# EAGLE design TriFet (EAGLE 6.2)
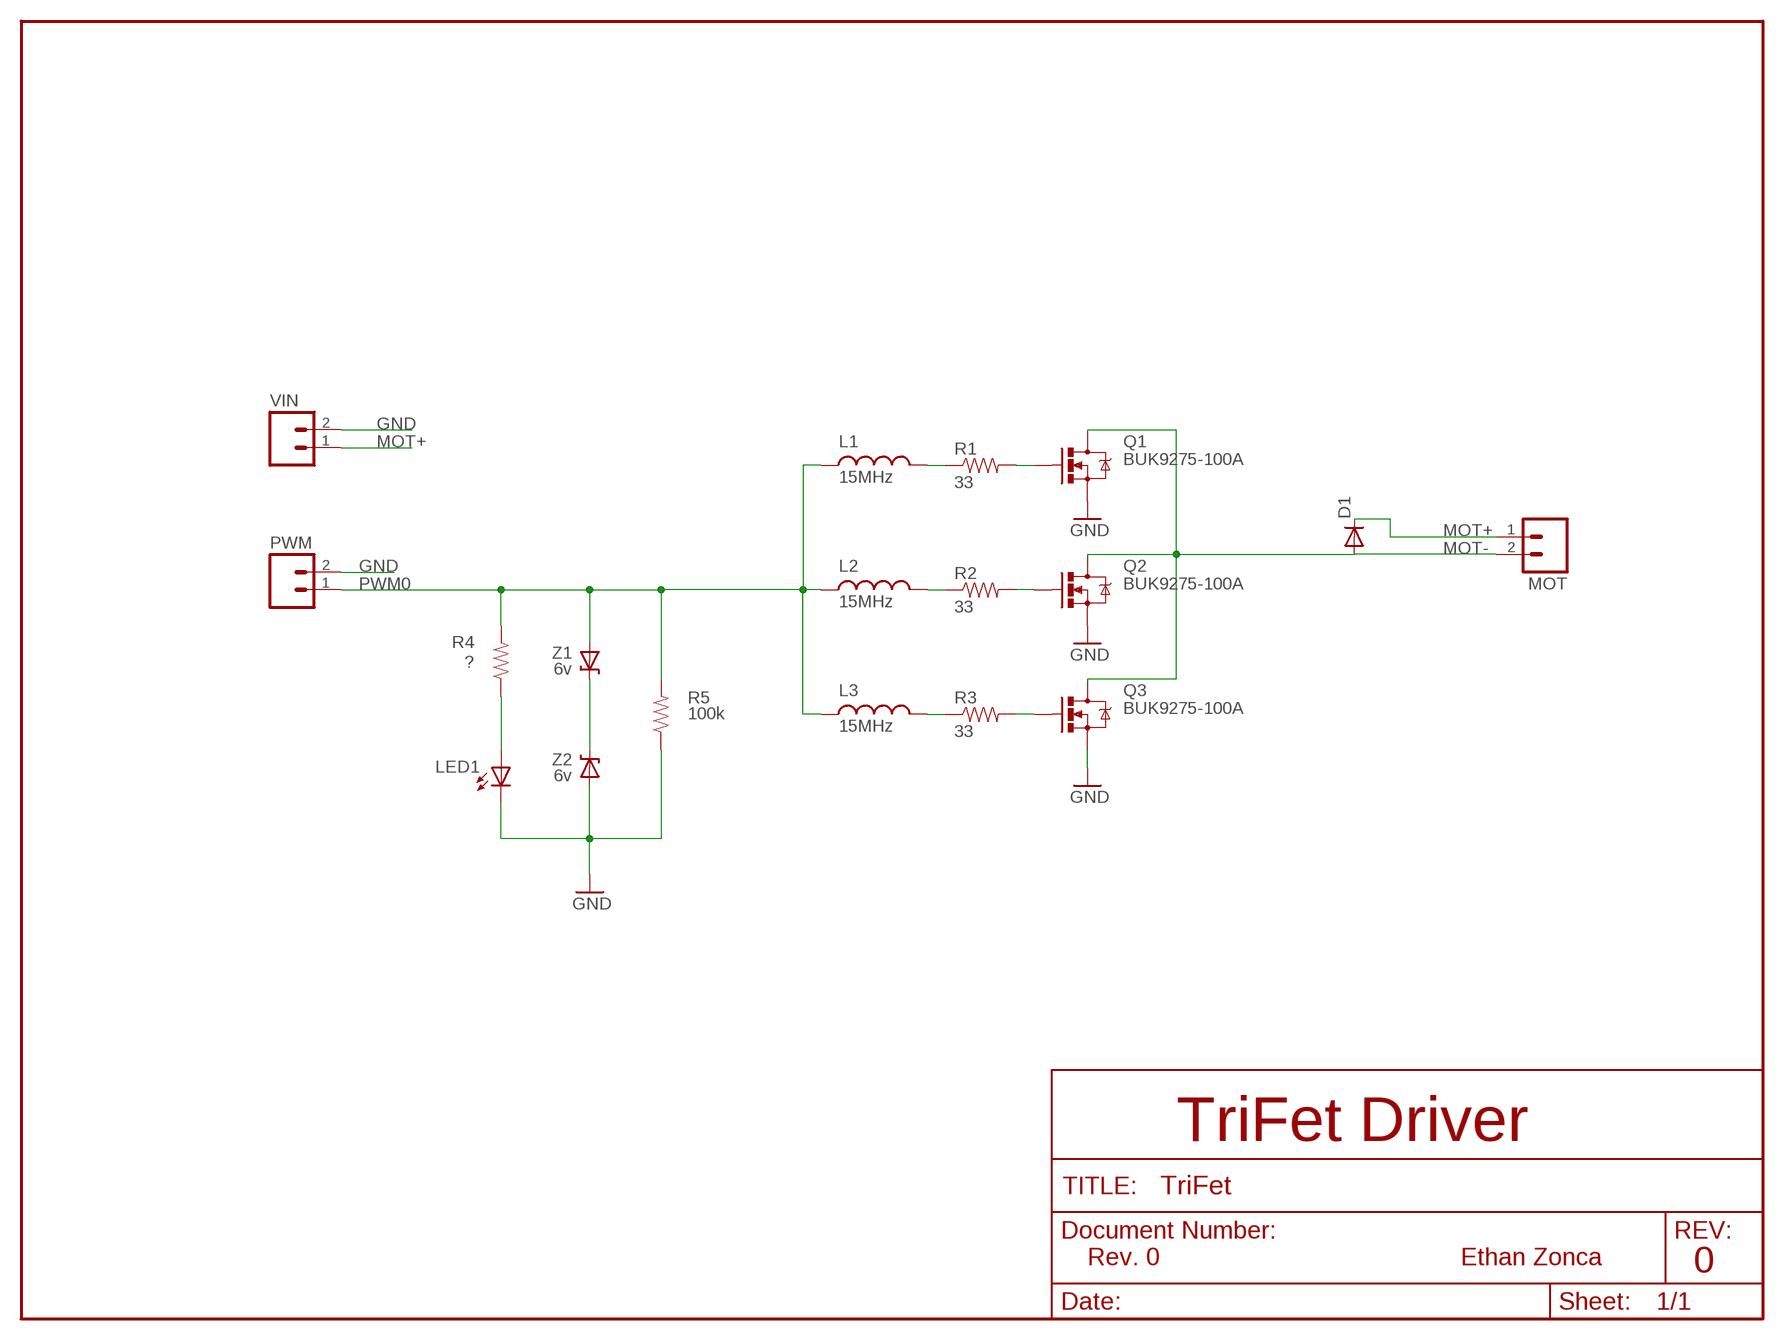
[diagram p0: schematic, sheet 1]

## Parts
D1  DIODESMB  [SMB-DIODE]
L1  15MHz  INDUCTOR0603  [0603]
L2  15MHz  INDUCTOR0603  [0603]
L3  15MHz  INDUCTOR0603  [0603]
LED1  LEDCHIP-LED0603  [CHIP-LED0603]
MOT  M023.5MM  [SCREWTERMINAL-3.5MM-2]
PWM  M023.5MM-NO_SILK  [SCREWTERMINAL-3.5MM-2-NS]
Q1  BUK9275-100A  MOSFET-NCHANNELFDD8580  [DPAK]
Q2  BUK9275-100A  MOSFET-NCHANNELFDD8580  [DPAK]
Q3  BUK9275-100A  MOSFET-NCHANNELFDD8580  [DPAK]
R1  33  RESISTOR0603-RES  [0603-RES]
R2  33  RESISTOR0603-RES  [0603-RES]
R3  33  RESISTOR0603-RES  [0603-RES]
R4  ?  RESISTOR0603-RES  [0603-RES]
R5  100k  RESISTOR0603-RES  [0603-RES]
VIN  M023.5MM-NO_SILK  [SCREWTERMINAL-3.5MM-2-NS]
Z1  6v  DIODE-ZENER-BZT52  [SOD-323]
Z2  6v  DIODE-ZENER-BZT52  [SOD-323]

## Nets
GND: LED1.C PWM.2 Q1.3(S) Q2.3(S) Q3.3(S) R5.1 VIN.2 Z2.2(A)
MOT+ [power]: D1.C MOT.1 VIN.1
MOT- [power]: D1.A MOT.2 Q1.4(D) Q2.4(D) Q3.4(D)
N$1: Q1.1(G) R1.2
N$2: L1.2 R1.1
N$3: LED1.A R4.1
N$4: L2.2 R2.1
N$5: Q2.1(G) R2.2
N$6: Z1.1(C) Z2.1(C)
N$7: L3.2 R3.1
N$8: Q3.1(G) R3.2
PWM0: L1.1 L2.1 L3.1 PWM.1 R4.2 R5.2 Z1.2(A)

## Notes on the sheet
- TriFet Driver
- Rev. 0 | Ethan Zonca
- 0

## Library data of the parts
D1 = SparkFun:DIODE: Diode These are standard reverse protection diodes and small signal diodes. SMA package can handle up to about 1A. SOD-323 can handle about 200mA. What the SOD-323 package when ordering, there are some mfgs out there that are 5-pin packages.
L1-L3 = SparkFun:INDUCTOR: Inductors Basic Inductor/Choke - 0603 and 1206. Footprints are not proven and vary greatly between part numbers.
LED1 = adafruit:LED: LED OSRAM: - CHIPLED LG R971, LG N971, LY N971, LG Q971, LY Q971, LO R971, LY R971 LH N974, LH R974 LS Q976, LO Q976, LY Q976 LO Q996 - Hyper CHIPLED LW Q18S LB Q993, LB Q99A, LB R99A - SideLED LS A670, LO A670, LY A670, LG A670, LP A670 LB A673, LV A673, LT A673, LW A673 LH A674 LY A675 LS A676, LA A676, LO A676, LY A676, LW A676 LS A679, LY A679, LG A679 - Hyper Micro SIDELED® LS Y876, LA Y876, LO Y876, LY Y876 LT Y87S - SmartLED LW L88C, LW L88S LB L89C, LB L89S, LG L890 LS L89K, LO L89K, LY L89K LS L896, LA L896, LO L896, LY L896 - TOPLED LS T670, LO T670, LY T670, LG T670, LP T670 LSG T670, LSP T670, LSY T670, LOP T670, LYG T670 LG T671, LOG T671, LSG T671 LB T673, LV T673, LT T673, LW T673 LH T674 LS T676, LA T676, LO T676, LY T676, LB T676, LH T676, LSB T676, LW T676 LB T67C, LV T67C, LT T67C, LS T67K, LO T67K, LY T67K, LW E67C LS E67B, LA E67B, LO E67B, LY E67B, LB E67C, LV E67C, LT E67C LW T67C LS T679, LY T679, LG T679 LS T770, LO T770, LY T770, LG T770, LP T770 LB T773, LV T773, LT T773, LW T773 LH T774 LS E675, LA E675, LY E675, LS T675 LS T776, LA T776, LO T776, LY T776, LB T776 LHGB T686 LT T68C, LB T68C - Hyper Mini TOPLED® LB M676 - Mini TOPLED Santana® LG M470 LS M47K, LO M47K, LY M47K Source: http://www.osram.convergy.de/
MOT PWM VIN = SparkFun:M02: Header 2 Standard 2-pin 0.1" header. Use with straight break away headers (SKU : PRT-00116), right angle break away headers (PRT-00553), swiss pins (PRT-00743), machine pins (PRT-00117), and female headers (PRT-00115). Molex polarized connector foot print use with SKU : PRT-08233 with associated crimp pins and housings.
Q1-Q3 = SparkFun:MOSFET-NCHANNEL
R1-R5 = SparkFun:RESISTOR: Resistor Basic schematic elements and footprints for 0603, 1206, and PTH resistors.
Z1 Z2 = SparkFun:DIODE-ZENER: Zener Diode Production Part - 8199 3.4V Zener Voltage

## Net classes
1 power: width 0.508 mm

## Board
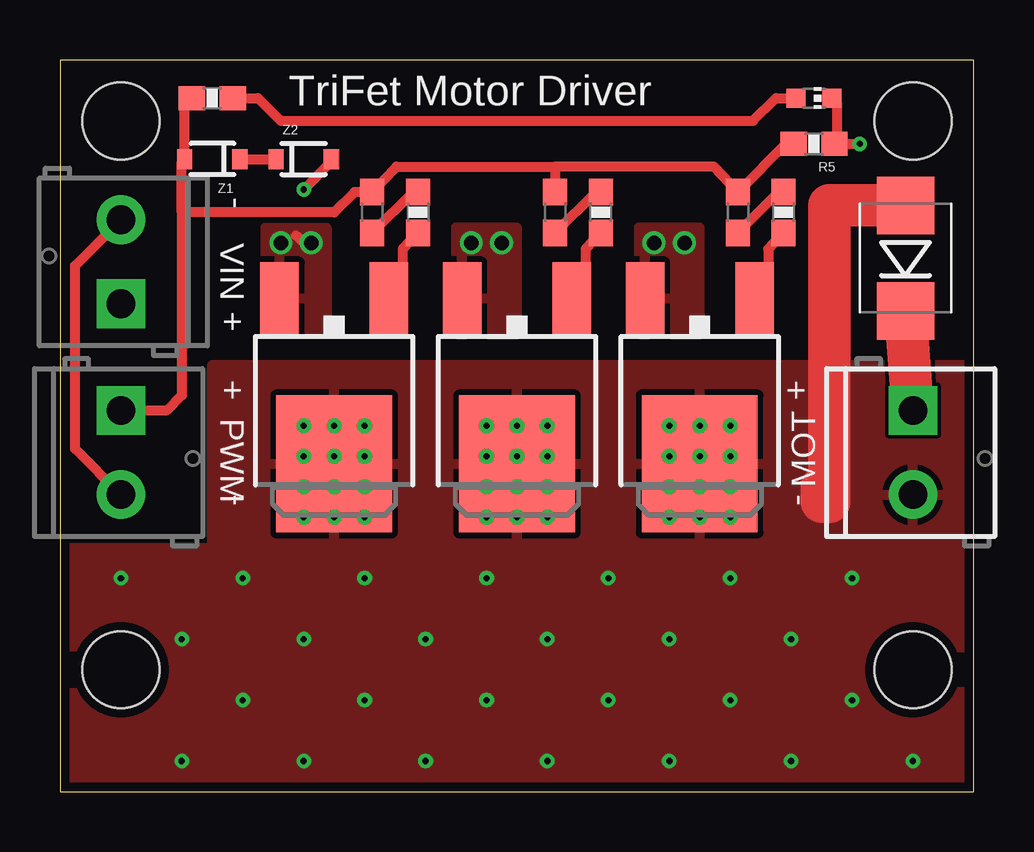
[diagram p1: board, top side]
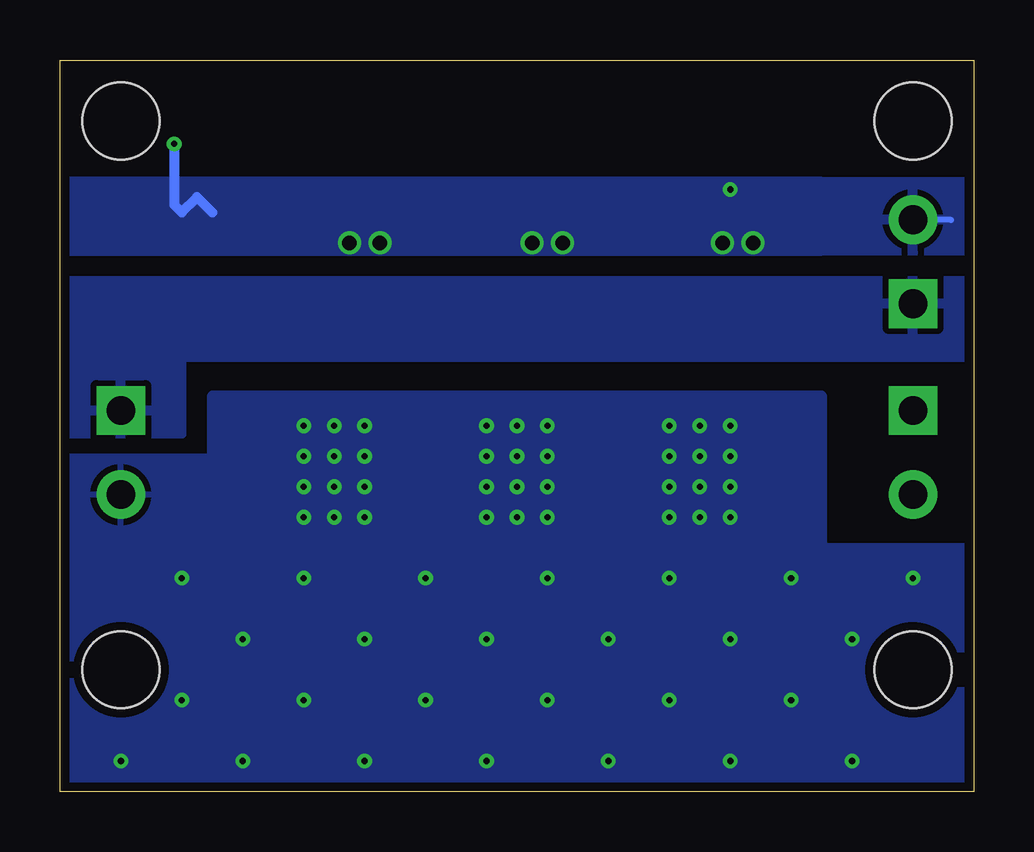
[diagram p2: board, bottom side, seen from below]

Size 38.1 x 30.48 mm. Coordinates in mm from the lower left corner, seen from the top.
Outline: 0,0 38.1,0 38.1,30.48 0,30.48 0,0
Copper layers (1*16): Top 0.0356mm / dielectric 1.5011mm / Bottom 0.0356mm
Design rules: minimum track width 6mil, minimum drill 13mil, track to track 6mil, track to pad 6mil, pad to pad 6mil, via to via 6mil, smd to smd 6mil, copper to edge 15mil, drill to drill 6mil, minimum pad ring 7mil, minimum via ring 7mil, stop-mask expansion 4mil, vias tented up to drill 0mil, thermal gap 10mil
Holes 3.2 mm at 2.54,5.08 35.56,5.08 2.54,27.94 35.56,27.94

### Footprints (pad centres in the part's own frame; a part is rotated, then mirrored left to right if it is on the bottom)
SMB-DIODE = smd 2.4 x 2.4: A 2.2,0; C -2.2,0
0603 = smd 1.1 x 1: 1 -0.85,0; 2 0.85,0
CHIP-LED0603 = smd 0.8 x 0.8: A 0,-0.75; C 0,0.75
SCREWTERMINAL-3.5MM-2 = drill 1.2 pad 2.032 square: 1 0,0 | drill 1.2 pad 2.032: 2 3.5,0
SCREWTERMINAL-3.5MM-2-NS = drill 1.2 pad 2.032 square: 1 0,0 | drill 1.2 pad 2.032: 2 3.5,0
DPAK = smd 1.6 x 3: 1 -2.28,-5.31; 3 2.28,-5.31 | smd 4.826 x 5.715: 4 0,1.588
0603-RES = smd 1.1 x 1: 1 -0.85,0; 2 0.85,0
SOD-323 = smd 0.63 x 0.83: 1 -1.15,0; 2 1.15,0

### Placement (x,y rotation side)
D1  35.24,22.23 90 top
L1  20.64,24.13 270 top
L2  13.02,24.13 270 top
L3  28.26,24.13 270 top
LED1  31.43,28.89 270 top
MOT  35.56,15.88 270 top
PWM  2.54,15.88 270 top
Q1  19.05,15.24 180 top
Q2  11.43,15.24 180 top
Q3  26.67,15.24 180 top
R1  22.54,24.13 270 top
R2  14.92,24.13 270 top
R3  30.16,24.13 270 top
R4  6.35,28.89 180 top
R5  31.43,26.99 180 top
VIN  2.54,20.32 90 top
Z1  6.35,26.35 180 top
Z2  10.16,26.35 0 top

### Tracks (layer width: path | path; a pad name or v marks a point on that pad's centre or on a via)
GND  (via drill 0.25, 0.6)
  Top 0.406: PWM.2 0.64,14.28 0.64,21.91 VIN.2 | LED1.C 32.38,28.69 32.38,27.09 R5.1 v33.34,26.99 | 9.84,23.18 10.16,22.86 v10.48,22.86 | Z2.2 11.31,26.23 v10.16,25.08
  Bottom 0.254: 0.96,23.82 VIN.2
  Bottom 0.406: 31.75,24.13 32.38,24.77 33.02,24.13 33.34,24.45 v33.34,26.99
  other vias: 9.21,22.86 17.14,22.86 18.41,22.86 24.77,22.86 26.04,22.86
  pour Bottom: 6.35,25.4 40.64,25.4 40.64,22.54 6.35,22.54
  pour Bottom: -1.27,25.4 -1.27,22.54 6.35,22.54 6.35,25.4
  pour Top: 8.57,23.5 11.11,23.5 11.11,19.05 8.57,19.05
  pour Top: 16.51,19.05 19.05,19.05 19.05,23.5 16.51,23.5
  pour Top: 24.13,19.05 26.67,19.05 26.67,23.5 24.13,23.5
MOT+
  Top 1.778: D1.C MOT.1
  pour Bottom: -1.59,21.27 -1.59,18.1 38.1,18.1 38.1,21.27
  pour Bottom: 39.37,19.05 39.37,14.92 33.02,14.92 33.02,19.05
MOT-  (via drill 0.25)
  Top 1.778: D1.A 32.07,24.43 32.07,12.06 31.75,12.06 31.75,12.7
  other vias: 12.7,15.24 10.16,15.24 11.43,15.24 10.16,13.97 11.43,13.97 12.7,13.97 10.16,12.7 11.43,12.7 12.7,12.7 10.16,11.43 11.43,11.43 12.7,11.43 17.78,15.24 19.05,15.24 20.32,15.24 17.78,13.97 19.05,13.97 20.32,13.97 17.78,12.7 19.05,12.7 20.32,12.7 17.78,11.43 19.05,11.43 20.32,11.43 25.4,15.24 26.67,15.24 27.94,15.24 25.4,13.97 26.67,13.97 27.94,13.97 25.4,12.7 26.67,12.7 27.94,12.7 25.4,11.43 26.67,11.43 27.94,11.43 7.62,8.89 10.16,6.35 12.7,8.89 15.24,6.35 17.78,8.89 20.32,6.35 22.86,8.89 25.4,6.35 27.94,8.89 30.48,6.35 33.02,8.89 5.08,6.35 2.54,8.89 7.62,3.81 12.7,3.81 17.78,3.81 22.86,3.81 27.94,3.81 33.02,3.81 35.56,1.27 30.48,1.27 25.4,1.27 20.32,1.27 15.24,1.27 10.16,1.27 5.08,1.27 27.94,15.24
  pour Top: 6.35,17.78 37.78,17.78 37.78,0 0,0 0,10.16 6.35,10.16
  pour Bottom: 6.35,16.51 6.35,10.16 0,10.16 0,-1.27 31.75,-1.27 31.75,16.51
  pour Bottom: 30.8,0 37.78,0 37.78,13.97 30.8,13.97
N$1
  Top 0.406: R1.2 21.91,22.59 21.91,20.32 21.68,20.55 Q1.1
N$2
  Top 0.406: R1.1 22.34,24.98 L1.2
N$3
  Top 0.406: R4.1 8.26,28.89 9.21,27.94 28.89,27.94 29.84,28.89 LED1.A
N$4
  Top 0.406: R2.1 14.72,24.98 L2.2
N$5
  Top 0.406: R2.2 14.29,22.59 14.29,20.64 14.2,20.55 Q2.1
N$6
  Top 0.406: Z1.1 Z2.1
N$7
  Top 0.406: R3.1 29.96,24.98 L3.2
N$8
  Top 0.406: R3.2 29.53,22.59 29.53,20.95 29.12,20.55 Q3.1
PWM0
  Top 0.406: 20.64,26.04 27.25,26.04 L3.1 30.27,26.99 R5.2 | 20.64,26.04 L1.1 | 20.64,26.04 14.02,26.04 L2.1 12.28,24.98 11.43,24.13 5.08,24.13 | 5.08,24.13 5.08,16.51 4.45,15.88 PWM.1 | R4.2 5.2,28.59 Z1.2 5.08,26.23 5.08,24.13

### Text on the board
tPlace: TriFet Motor Driver
tNames: - | + | + | + | - | -
bStop: TriFet Motor Driver | Ethan Zonca - 2012